# Altium schematic sheet 主机.SchDoc
size A4
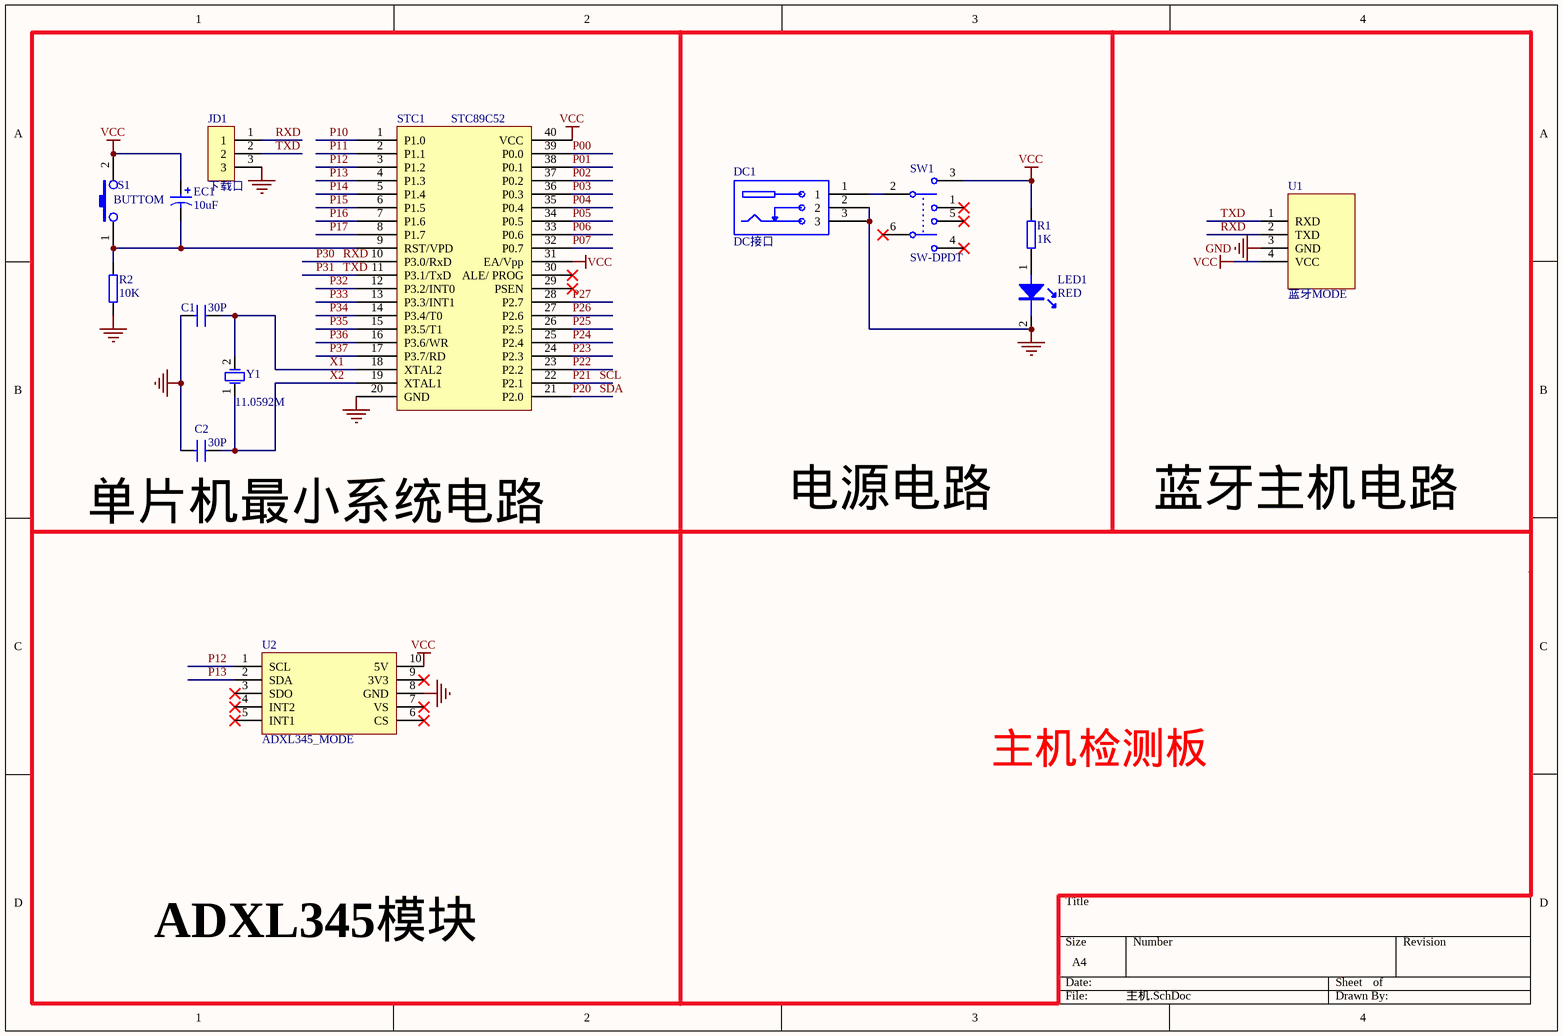
[diagram p0: 主机.SchDoc]

## Parts
C1  30P  [RAD-0.1]
C2  30P  [RAD-0.1]
DC1  DC接口  [DC-JACK-002]
EC1  10uF  [RB.1/.2]
JD1  下载口  [下载串口]
LED1  RED  [LED_D3MM12]
R1  1K  [AXIAL0.3]
R2  10K  [AXIAL0.3]
S1  BUTTOM  [BUTTOM_6x6DIP]
STC1  STC89C52  [STC89]
SW1  SW-DPDT  [SW]
U1  蓝牙MODE  [蓝牙MODE平放]
U2  ADXL345_MODE  [ADXL345MODE]
Y1  11.0592M  [X_HC-49]

## Nets
GND: C1.1 C2.1 DC1.2 DC1.3 JD1.3 LED1.2 R2.1 STC1.20(GND) U1.3(GND) U2.8(GND)
VCC: EC1.1 R1.2 S1.2 STC1.31(EA/Vpp) STC1.40(VCC) SW1.3 U1.4(VCC) U2.10(5V)
P00: STC1.39(P0.0)
P01: STC1.38(P0.1)
P02: STC1.37(P0.2)
P03: STC1.36(P0.3)
P04: STC1.35(P0.4)
P05: STC1.34(P0.5)
P06: STC1.33(P0.6)
P07: STC1.32(P0.7)
P10: STC1.1(P1.0)
P11: STC1.2(P1.1)
P12: STC1.3(P1.2) U2.1(SCL)
P13: STC1.4(P1.3) U2.2(SDA)
P14: STC1.5(P1.4)
P15: STC1.6(P1.5)
P16: STC1.7(P1.6)
P17: STC1.8(P1.7)
P20: STC1.21(P2.0)  [also labelled SDA]
P21: STC1.22(P2.1)  [also labelled SCL]
P22: STC1.23(P2.2)
P23: STC1.24(P2.3)
P24: STC1.25(P2.4)
P25: STC1.26(P2.5)
P26: STC1.27(P2.6)
P27: STC1.28(P2.7)
P30: JD1.1 STC1.10(P3.0/RxD) U1.2(TXD)  [also labelled RXD]
P31: JD1.2 STC1.11(P3.1/TxD) U1.1(RXD)  [also labelled TXD]
P32: STC1.12(P3.2/INT0)
P33: STC1.13(P3.3/INT1)
P34: STC1.14(P3.4/T0)
P35: STC1.15(P3.5/T1)
P36: STC1.16(P3.6/WR)
P37: STC1.17(P3.7/RD)
X1: C1.2 STC1.18(XTAL2) Y1.2(OSC2)
X2: C2.2 STC1.19(XTAL1) Y1.1(OSC1)
NetDC1_1: DC1.1 SW1.2
NetEC1_2: EC1.2 R2.2 S1.1 STC1.9(RST/VPD)
NetLED1_1: LED1.1 R1.1

Not connected (* = marked no-connect by the designer): STC1 29(PSEN)* 30(ALE/_PROG)*; SW1 1* 4* 5* 6*; U2 3(SDO)* 4(INT2)* 5(INT1)* 6(CS)* 7(VS)* 9(3V3)*

## Notes on the sheet
- 电源电路
- 蓝牙主机电路
- (near C2) 单片机最小系统电路
- 主机检测板
- ADXL345模块

## Library data of the parts
C1 C2 = CAP: 无极性电容
DC1 = DC接口: DC接口（分大小）
EC1 = CAP_EC: 极性电容
JD1 = 下载口: 下载口2.54排针
LED1 = LED: LED灯
R1 R2 = RES: 电阻
S1 = BUTTOM: 按键
STC1 = STC51: 51单片机
SW1 = SW-DPDT: 电源开关; Published: 24-Mar-1999; LatestRevisionDate: 17-Jul-2002; LatestRevisionNote: Re-released for DXP Platform.; PackageReference: DPDT-6; Publisher: Altium Limited
U1 = 蓝牙MODE: 蓝牙模块
U2 = ADXL345_MODE: ADXL345 倾斜模块
Y1 = XTAL DIP: 晶振